# Altium schematic sheet TsinghuaDoor_top.SchDoc
size A4
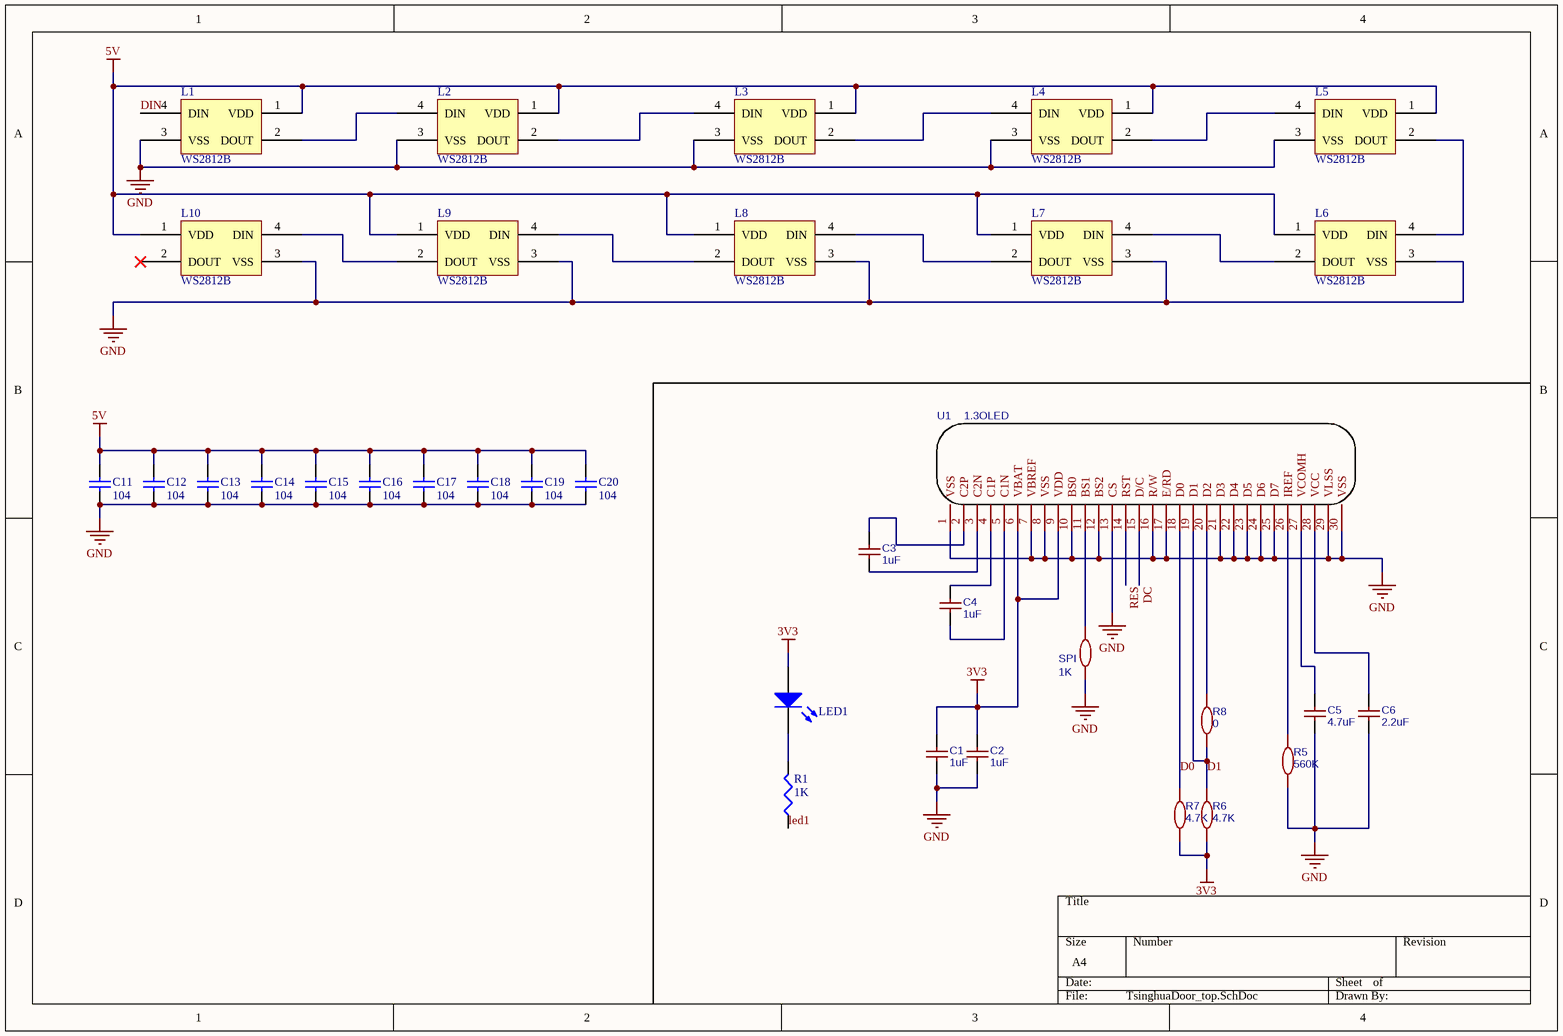
[diagram p0: TsinghuaDoor_top.SchDoc]

## Parts
C1  1uF  [0805]
C2  1uF  [0805]
C3  1uF  [0805]
C4  1uF  [0805]
C5  4.7uF  [0805]
C6  2.2uF  [0805]
C11  value 104  [电容-0805]  (hidden comment: 2电容)
C12  value 104  [电容-0805]  (hidden comment: 2电容)
C13  value 104  [电容-0805]  (hidden comment: 2电容)
C14  value 104  [电容-0805]  (hidden comment: 2电容)
C15  value 104  [电容-0805]  (hidden comment: 2电容)
C16  value 104  [电容-0805]  (hidden comment: 2电容)
C17  value 104  [电容-0805]  (hidden comment: 2电容)
C18  value 104  [电容-0805]  (hidden comment: 2电容)
C19  value 104  [电容-0805]  (hidden comment: 2电容)
C20  value 104  [电容-0805]  (hidden comment: 2电容)
L1  WS2812B  [WS2812B]
L2  WS2812B  [WS2812B]
L3  WS2812B  [WS2812B]
L4  WS2812B  [WS2812B]
L5  WS2812B  [WS2812B]
L6  WS2812B  [WS2812B]
L7  WS2812B  [WS2812B]
L8  WS2812B  [WS2812B]
L9  WS2812B  [WS2812B]
L10  WS2812B  [WS2812B]
LED1  5LED  [led_0603]  (value not drawn)
R1  value 1K  [电阻_0603]  (hidden comment: 1电阻)
R5  560K  [0805]
R6  4.7K  [0805]
R7  4.7K  [0805]
R8  0  [0805]
SPI  1K  [0805]
U1  1.3OLED  [1.3-OLED-BOTTOM(CHN)]

## Nets
3V3: C1.2 C2.2 LED1.1(A) R6.1 R7.1 U1.6(VBAT) U1.9(VDD)
5V: C11.2 C12.2 C13.2 C14.2 C15.2 C16.2 C17.2 C18.2 C19.2 C20.2 L1.1(VDD) L2.1(VDD) L3.1(VDD) L4.1(VDD) L5.1(VDD) L6.1(VDD) L7.1(VDD) L8.1(VDD) L9.1(VDD) L10.1(VDD)
GND: C1.1 C2.1 C5.1 C6.1 C11.1 C12.1 C13.1 C14.1 C15.1 C16.1 C17.1 C18.1 C19.1 C20.1 L1.3(VSS) L2.3(VSS) L3.3(VSS) L4.3(VSS) L5.3(VSS) L6.3(VSS) L7.3(VSS) L8.3(VSS) L9.3(VSS) L10.3(VSS) R5.1 SPI.1 U1.1(VSS) U1.7(VBREF) U1.8(VSS) U1.10(BS0) U1.12(BS2) U1.13(CS) U1.16(R/W) U1.17(E/RD) U1.21(D3) U1.22(D4) U1.23(D5) U1.24(D6) U1.25(D7) U1.29(VLSS) U1.30(VSS)
D0: R7.2 U1.18(D0)
D1: R6.2 R8.1 U1.19(D1)
DC: U1.15(D/C)
DIN: L1.4(DIN)
led1: R1.1
RES: U1.14(RST)
NetC3_1: C3.1 U1.3(C2N)
NetC3_2: C3.2 U1.2(C2P)
NetC4_1: C4.1 U1.5(C1N)
NetC4_2: C4.2 U1.4(C1P)
NetC5_2: C5.2 U1.27(VCOMH)
NetC6_2: C6.2 U1.28(VCC)
NetL1_2: L1.2(DOUT) L2.4(DIN)
NetL2_2: L2.2(DOUT) L3.4(DIN)
NetL3_2: L3.2(DOUT) L4.4(DIN)
NetL4_2: L4.2(DOUT) L5.4(DIN)
NetL5_2: L5.2(DOUT) L6.4(DIN)
NetL6_2: L6.2(DOUT) L7.4(DIN)
NetL7_2: L7.2(DOUT) L8.4(DIN)
NetL8_2: L8.2(DOUT) L9.4(DIN)
NetL9_2: L9.2(DOUT) L10.4(DIN)
NetLED1_2: LED1.2(K) R1.2
NetR5_2: R5.2 U1.26(IREF)
NetR8_2: R8.2 U1.20(D2)
NetSPI_2: SPI.2 U1.11(BS1)

Not connected (* = marked no-connect by the designer): L10 2(DOUT)*

## Library data of the parts
C1-C4 = 1uF: BOM_Manufacturer Part: CL21B105KBFNNNE; BOM_Manufacturer: SAMSUNG; nameAlias: Capacitance; BOM_Supplier: LCSC; BOM_LCSC Assembly: Yes; BOM_Supplier Part: C28323; spicePre: C; spiceSymbolName: 105（0805）1uf
C5 C6 = 2.2uF: BOM_Manufacturer Part: CL21B105KBFNNNE; BOM_Manufacturer: SAMSUNG; nameAlias: Capacitance; BOM_Supplier: LCSC; BOM_LCSC Assembly: Yes; BOM_Supplier Part: C28323; spicePre: C; spiceSymbolName: 105（0805）1uf
C11-C20 = 2电容: Capacitor; Published: 8-Jun-2000; LatestRevisionDate: 17-Jul-2002; LatestRevisionNote: Re-released for DXP Platform.; PackageReference: RAD-0.3; Publisher: Altium Limited; PackageDescription: Radial Cap, Thru-Hole; 2 Leads; 0.3 in Pin Spacing
LED1 = 5LED: Typical INFRARED GaAs LED; Published: 8-Jun-2000; LatestRevisionDate: 08-Jul-2005; LatestRevisionNote: Mech Layer 1 removed.; Publisher: Altium Limited; PackageDescription: LED; 2 Leads
R1 = 1电阻: Resistor; Published: 8-Jun-2000; LatestRevisionDate: 29-May-2009; LatestRevisionNote: IPC-7351 Footprint Added.; PackageReference: J1-0603; Publisher: Altium Limited; PackageDescription: Chip Resistor
R5 = 560K: BOM_Manufacturer: Uniroyal Elec; BOM_Manufacturer Part: 0805W8F3922T5E; nameAlias: Resistance (Ohms); Contributor: hxf7582; BOM_Supplier: LCSC; BOM_Supplier Part: C60005; spicePre: R; spiceSymbolName: 电阻0805
R6 R7 = 4.7K: BOM_Manufacturer: Uniroyal Elec; BOM_Manufacturer Part: 0805W8F3922T5E; nameAlias: Resistance (Ohms); Contributor: hxf7582; BOM_Supplier: LCSC; BOM_Supplier Part: C60005; spicePre: R; spiceSymbolName: 电阻0805
R8 = 0: BOM_Manufacturer: Uniroyal Elec; BOM_Manufacturer Part: 0805W8F3922T5E; nameAlias: Resistance (Ohms); Contributor: hxf7582; BOM_Supplier: LCSC; BOM_Supplier Part: C60005; spicePre: R; spiceSymbolName: 电阻0805
SPI = 1K: BOM_Manufacturer: Uniroyal Elec; BOM_Manufacturer Part: 0805W8F3922T5E; nameAlias: Resistance (Ohms); Contributor: hxf7582; BOM_Supplier: LCSC; BOM_Supplier Part: C60005; spicePre: R; spiceSymbolName: 电阻0805
U1 = 1.3OLED: Contributor: 01bffe806c; sourceId: oc60UctnF; timeStamp: 1472395360; spicePre: U